# Altium project Payload.PrjPcb
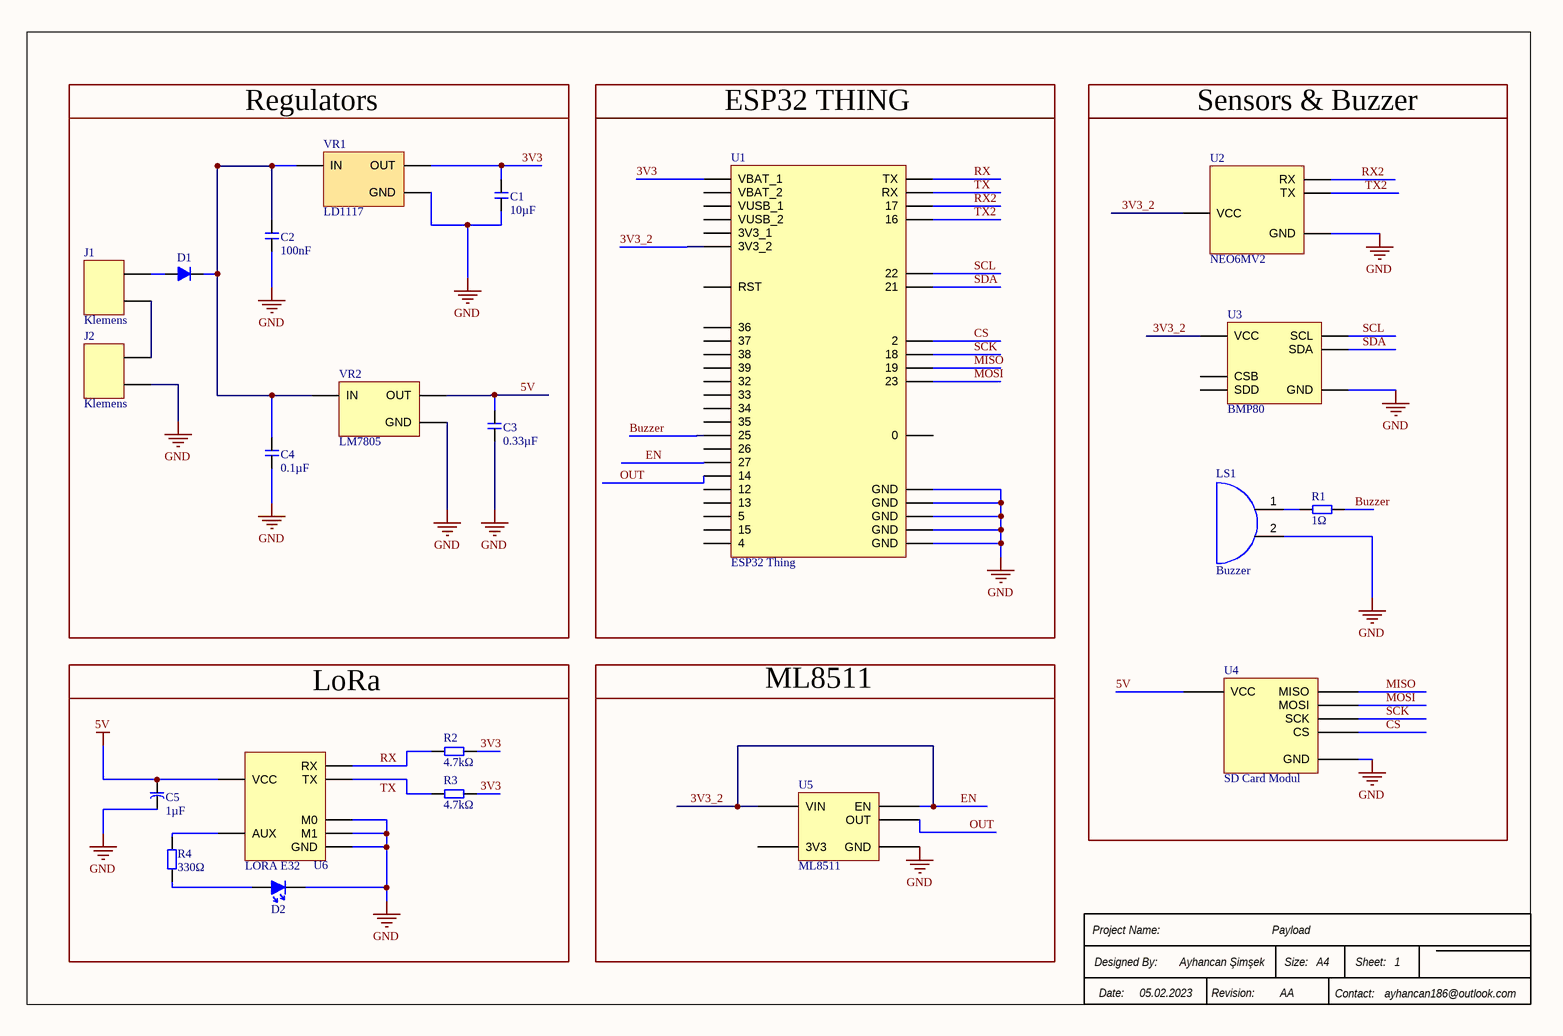
[diagram p0: Sheet2.SchDoc]
1 sheet, 22 parts. Net scope: global (net labels, ports and power ports of the same name join across sheets).
Board file: PCB2.PcbDoc

## Sheet Sheet2.SchDoc
size A4; Date: 05.02.2023; Revision: AA; SheetNumber: 1; SheetTotal: 1; Project_Name: Payload; Sheet: 1

### Parts
C1  10µF  [LCapacitor]
C2  100nF  [LCapacitor]
C3  0.33µF  [LCapacitor]
C4  0.1µF  [LCapacitor]
C5  1µF  [Capacitor]
D1  Diode  [Zener]  (value not drawn)
D2  Led  [LED]  (value not drawn)
J1  Klemens  [Klemens]
J2  Klemens  [Klemens]
LS1  Buzzer  [Buzzer]
R1  1Ω  [Resistor]
R2  4.7kΩ  [Resistor]
R3  4.7kΩ  [Resistor]
R4  330Ω  [Resistor]
U1  ESP32 Thing  [ESP32 THING]
U2  NEO6MV2  [NEO6MV2]
U3  BMP80  [BMP280]
U4  SD Card Modul  [SD Card Modülü]
U5  ML8511  [ML8511]
U6  LORA E32  [LORAE32]
VR1  LD1117  [LD1117]
VR2  LM7805  [LM7805]

### Blocks framed on the sheet
Regulators: C1-C4 D1 J1 J2 VR1 VR2
ESP32 THING: U1
Sensors & Buzzer: LS1 R1 U2-U4
LoRa: C5 D2 R2-R4 U6
ML8511: U5

### Nets
5V: C3.2 C5.1 U4.0(VCC) U6.2(VCC) VR2.3(OUT)
GND: C1.1 C2.1 C3.1 C4.1 C5.2 D2.1 J2.1 LS1.2 U1.GND_1(GND) U1.GND_2(GND) U1.GND_3(GND) U1.GND_4(GND) U1.GND_5(GND) U2.4(GND) U3.2(GND) U4.5(GND) U5.GND U6.1(GND) U6.6(M1) U6.7(M0) VR1.3(GND) VR2.2(GND)
3V3: C1.2 R2.2 R3.2 U1.VBAT_1 VR1.2(OUT)
3V3_2: U1.3V3_2 U1.27 U2.1(VCC) U3.1(VCC) U5.EN U5.VIN  [also labelled EN]
Buzzer: R1.1 U1.25
CS: U1.2 U4.4(CS)
MISO: U1.19 U4.3(MISO)
MOSI: U1.23 U4.2(MOSI)
OUT: U1.14 U5.OUT
RX: R2.1 U1.TX U6.5(RX)
RX2: U1.17 U2.2(RX)
SCK: U1.18 U4.1(SCK)
SCL: U1.22 U3.3(SCL)
SDA: U1.21 U3.4(SDA)
TX: R3.1 U1.RX U6.4(TX)
TX2: U1.16 U2.3(TX)
NetC2_2: C2.2 C4.2 D1.2 VR1.1(IN) VR2.1(IN)
NetD1_1: D1.1 J1.0
NetD2_2: D2.2 R4.1
NetJ1_1: J1.1 J2.0
NetLS1_1: LS1.1 R1.2
NetR4_2: R4.2 U6.3(AUX)

Not connected (* = marked no-connect by the designer): U1 0 3V3_1 4 5 12 13 15 26 32 33 34 35 36 37 38 39 RST VBAT_2 VUSB_1 VUSB_2; U3 5(CSB) 6(SDD); U5 3V3

### Notes on the sheet
- Date:
- Project Name:
- Designed By:
- Ayhancan Şimşek
- Revision:
- Size:
- A4
- Contact:
- Sheet:
- ayhancan186@outlook.com

### Library data of the parts
C1-C4 = Capacitor
C5 = DCapacitor
R1-R4 = Resistor
U1 = ESP32 Thing: ESP32 802.11 Wireless LAN/Combo Wireless Module Development Kit; Manufacturer: SparkFun; Manufacturer Part Number: DEV-13907; Frequency: 2.4GHz; Supplier 1: Digi-Key; RoHS: No; Category: RF Semiconductors and Devices; Stock 1: 568; Pricing 1: 1=23,50000 (USD); ComponentLink1URL: https://github.com/sparkfun/ESP32_Thing?src-supplier=Digi-Key; ComponentLink1Description: https://github.com/sparkfun/ESP32_Thing?src-supplier=Digi-Key; Supplier Part Number 1: 1568-1444-ND
U2 = NEO6MV2: U#NEO-6M Gps Module U-BLOX6 SMD24P; Manufacturer: u-blox; Manufacturer Part Number: NEO-6M-0; Supplier 1: Mouser; RoHS: Yes; Stock 1: 236; Pricing 1: 1=60,00000, 10=41,87000, 50=27,23000, 100=17,72000, 1000=17,72000, 10000=17,72000 (USD); RoHS Compliant: Yes; Supplier Part Number 1: 377-NEO-6M-0
U3 = BMP80: Washer; #2 Screw Clr; 3/32 ID; 1/4 OD; 1/32 Height; Nylon; Manufacturer: Bosch; Output Type: SPI,I2C; Pressure Type: Absolute; Operating Pressure: 15.95PSI; Port Style: No Port; Max Pressure: 290.08PSI; Sensor Type: Temperature; Interface: I2C,SPI; Evaluation Kit: Yes; Supplier 1: Future Electronics; Manufacturer Part Number: BMP280; RoHS: No; Category: Pressure Sensors; Case/Package: SMD/SMT; Number of Pins: 8; Min Operating Temperature: -40°C; Max Operating Temperature: 85°C; Termination: SMD/SMT; Lead Free: Lead Free; ComponentLink1URL: https://ae-bst.resource.bosch.com/media/_tech/media/datasheets/BST-BMP280-DS001.pdf?src-supplier=Digi-Key; ComponentLink1Description: https://ae-bst.resource.bosch.com/media/_tech/media/datasheets/BST-BMP280-DS001.pdf?src-supplier=Digi-Key; Supplier Part Number 1: BMP280; Supplier 2: Mouser; Stock 2: 658; Pricing 2: 1=14,95000, 10=14,95000, 50=14,95000, 100=14,95000, 1000=14,95000, 10000=14,95000 (USD); Package Quantity: 1; ComponentLink2URL: http://www.mouser.com/ds/2/737/adafruit-bme280-humidity-barometric-pressure-tempe-740823.pdf?src-supplier=Mouser; ComponentLink2Description: http://www.mouser.com/ds/2/737/adafruit-bme280-humidity-barometric-pressure-tempe-740823.pdf?src-supplier=Mouser; ComponentLink3URL: https://learn.adafruit.com/downloads/pdf/adafruit-bme280-humidity-barometric-pressure-temperature-sensor-breakout.pdf?src-supplier=Digi-Key; ComponentLink3Description: https://learn.adafruit.com/downloads/pdf/adafruit-bme280-humidity-barometric-pressure-temperature-sensor-breakout.pdf?src-supplier=Digi-Key; Supplier Part Number 2: 485-2652
U5 = ML8511: IC, Uv Sensor, Voltage Output, QFN-12; Manufacturer: Rohm; Manufacturer Part Number: ML8511-00FCZ05B; Min Supply Voltage: 2.7V; Max Supply Voltage: 3.6V; Wavelength: 365nm; Diode Type: PIN; Dark Current: 100nA; Supplier 1: Digi-Key; RoHS: Yes; Mount: Surface Mount; Case/Package: SMD/SMT; Number of Pins: 12; Color: Black; Material: PO,Polyolefin; Min Operating Temperature: -20°C; Max Operating Temperature: 70°C; Packaging: Cut Tape; Package Quantity: 1; Series: -; Output Type: Voltage; Lead Free: Lead Free; ComponentLink1URL: https://datasheet.ciiva.com/18466/ml8511-3-8-13-18466971.pdf?src-supplier=Digi-Key; ComponentLink1Description: https://datasheet.ciiva.com/18466/ml8511-3-8-13-18466971.pdf?src-supplier=Digi-Key; ComponentLink2URL: https://datasheet.ciiva.com/18466/ml8511-3-8-13-18466972.pdf?src-supplier=Digi-Key; ComponentLink2Description: https://datasheet.ciiva.com/18466/ml8511-3-8-13-18466972.pdf?src-supplier=Digi-Key; ComponentLink3URL: https://datasheet.ciiva.com/18466/ml8511-3-8-13-18466973.pdf?src-supplier=Digi-Key; ComponentLink3Description: https://datasheet.ciiva.com/18466/ml8511-3-8-13-18466973.pdf?src-supplier=Digi-Key; Supplier Part Number 1: ML8511-00FCZ05BCT-ND
U6 = LORA E32: WiFi-Modul 802.11/BT 2, 4-2, 5GHz 150Mb/s; Manufacturer: Espressif Systems; Manufacturer Part Number: ESP32-S3-WROOM-1-N16R8; Supplier 1: Digi-Key; RoHS: No; Category: Uncategorized; Stock 1: 327; Pricing 1: 1=4,29000 (USD); Supplier Part Number 1: 1965-ESP32-S3-WROOM-1-N16R8CT-ND
VR1 = LD1117: LDO Regulator Pos 3.3V 1.3A 3-Pin(3+Tab) TO-220 Tube (Alt: LD1117V33C); Manufacturer: STMicroelectronics; Number of Outputs: 1; Max Input Voltage: 15V; Max Power Dissipation: 12W; Polarity: Positive; Quiescent Current: 10mA; Accuracy: 1%; Output Type: Fixed; Output Current: 800mA; Dropout Voltage: 1.1V; Input Bias Current: 5mA; Supplier 1: Digi-Key; Manufacturer Part Number: LD1117V33C; RoHS: Yes; Category: Voltage Regulators - Linear; Stock 1: 30; Pricing 1: 1=0,84000, 10=0,74000, 25=0,69520, 100=0,56750, 250=0,52708, 500=0,44860, 1000=0,37030 (USD); Mount: Through Hole; Case/Package: TO; Number of Pins: 3; Weight: 0.02lb; Min Operating Temperature: -40°C; Max Operating Temperature: 125°C; Output Voltage: 3.3V; Max Output Current: 1.3A; Packaging: Rail/Tube; Number of Regulators: 1; Package Quantity: 50; Nominal Output Voltage: 3.3V; Power Dissipation: 12W; Min Output Voltage: 3.3V; Output Voltage Accuracy: 1%; Series: -; Length: 10.4mm; Width: 4.6mm; Height: 9.15mm; Radiation Hardening: No; RoHS Compliant: Yes; REACH SVHC: No SVHC; Lead Free: Lead Free; ComponentLink1URL: https://datasheet.ciiva.com/1511/1776449-1511580.pdf?src-supplier=Element14; ComponentLink1Description: https://datasheet.ciiva.com/1511/1776449-1511580.pdf?src-supplier=Element14; ComponentLink2URL: https://datasheet.ciiva.com/16226/cd00000544-16226333.pdf?src-supplier=Future+Electronics; ComponentLink2Description: https://datasheet.ciiva.com/16226/cd00000544-16226333.pdf?src-supplier=Future+Electronics; ComponentLink3URL: https://datasheet.ciiva.com/2044/cd00000544-2044110.pdf?src-supplier=Digi-Key; ComponentLink3Description: https://datasheet.ciiva.com/2044/cd00000544-2044110.pdf?src-supplier=Digi-Key; Supplier Part Number 1: 497-1492-5-ND
VR2 = LM7805: LM78XX Series 5 V Fixed Output 1 A 3-Terminal LDO Voltage Regulator - TO-220; Manufacturer: ON Semiconductor / Fairchild; Manufacturer Part Number: LM7805CT; Output Voltage: 5V; Number of Outputs: 1; Max Input Voltage: 35V; Output Current: 1A; Min Input Voltage: 7V; Polarity: Positive; Dropout Voltage: 2V; Quiescent Current: 8mA; Accuracy: 4%; Power Supply Rejection Ratio (PSRR): 73dB; Max Output Voltage: 5.2V; Supplier 1: Digi-Key; RoHS: Yes; Category: Voltage Regulators - Linear; Mount: Through Hole; Case/Package: TO-220-3; Number of Pins: 3; Weight: 1.214g; Min Operating Temperature: -40°C; Max Operating Temperature: 125°C; Packaging: Rail/Tube; Output Type: Fixed; Max Output Current: 1A; Number of Regulators: 1; Output Voltage Accuracy: 4%; Package Quantity: 50; Current Rating: 1A; Nominal Output Voltage: 5V; Min Output Voltage: 5V; Length: 10.67mm; Width: 4.7mm; Height: 16.3mm; Radiation Hardening: No; RoHS Compliant: Yes; Lead Free: Lead Free; REACH SVHC: No SVHC; ComponentLink1URL: https://datasheet.ciiva.com/19456/786138-19456361.pdf?src-supplier=Jameco; ComponentLink1Description: https://datasheet.ciiva.com/19456/786138-19456361.pdf?src-supplier=Jameco; ComponentLink2URL: https://datasheet.ciiva.com/1512/1855686-1512105.pdf?src-supplier=Element14; ComponentLink2Description: https://datasheet.ciiva.com/1512/1855686-1512105.pdf?src-supplier=Element14; ComponentLink3URL: https://datasheet.ciiva.com/1512/1855686-1512106.pdf?src-supplier=Element14; ComponentLink3Description: https://datasheet.ciiva.com/1512/1855686-1512106.pdf?src-supplier=Element14; ComponentLink4URL: https://datasheet.ciiva.com/1511/1855686-1511835.pdf?src-supplier=Element14; ComponentLink4Description: https://datasheet.ciiva.com/1511/1855686-1511835.pdf?src-supplier=Element14; ComponentLink5URL: https://datasheet.ciiva.com/8239/lm7812-8239478.pdf?src-supplier=Avnet; ComponentLink5Description: https://datasheet.ciiva.com/8239/lm7812-8239478.pdf?src-supplier=Avnet; ComponentLink6URL: https://datasheet.ciiva.com/17332/lm7805-17332792.pdf?src-supplier=Future+Electronics; ComponentLink6Description: https://datasheet.ciiva.com/17332/lm7805-17332792.pdf?src-supplier=Future+Electronics; ComponentLink7URL: https://datasheet.ciiva.com/2039/lm7805-2039365.pdf?src-supplier=Digi-Key; ComponentLink7Description: https://datasheet.ciiva.com/2039/lm7805-2039365.pdf?src-supplier=Digi-Key; ComponentLink8URL: https://datasheet.ciiva.com/48694/001253095-da-01-en-ic-reg-ldo-5v-1a-lm7805ct-to-220-3-fsc-48694790.pdf?src-supplier=Conrad; ComponentLink8Description: https://datasheet.ciiva.com/48694/001253095-da-01-en-ic-reg-ldo-5v-1a-lm7805ct-to-220-3-fsc-48694790.pdf?src-supplier=Conrad; Supplier Part Number 1: LM7805CT-ND
U4 = SD Card Modul: ComponentLink1Description: Datasheet; ComponentLink1URL: https://www.robolinkmarket.com/mikro-sd-kart-modulu?gclid=CjwKCAiAmuKbBhA2EiwAxQnt78OaB-zGV_fY0ZC8aCN55WRXhNGCRLTzrWpBnvPU45m0bp0klij65RoCjc0QAvD_BwE